# Altium schematic sheet DP_PS.schdoc: TEBF0808 - DisplayPort
size A4; DocumentNumber: TEBF0808; Revision: 04; SheetNumber: 10; SheetTotal: 36; Date: 2016-09-29; CompanyName: Trenz Electronic GmbH; Organization: Trenz Electronic GmbH
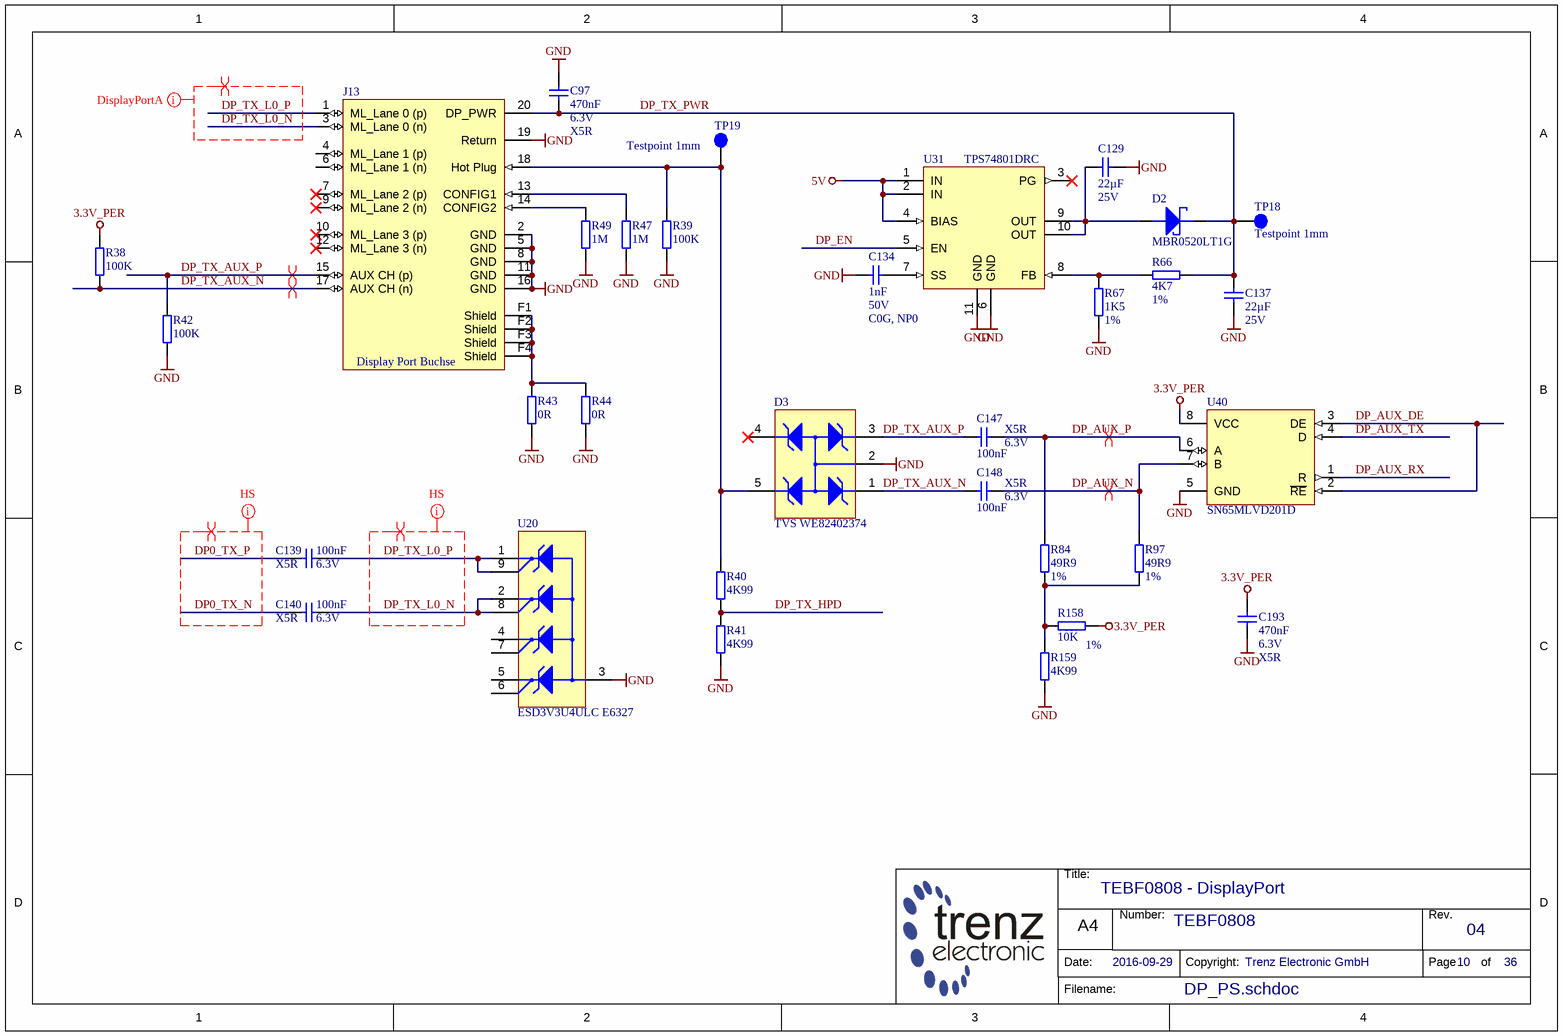
[diagram p0: DP_PS.schdoc]

## Parts
C97  470nF  Voltage: 6.3V  Technology: X5R  [CAPC1005X55N]
C129  22µF  Voltage: 25V  [CAPC3216X180N]
C134  1nF  Voltage: 50V  Technology: C0G, NP0  [CAPC1005X55N]
C137  22µF  Voltage: 25V  [CAPC3216X180N]
C139  100nF  Voltage: 6.3V  Technology: X5R  [CAPC0603X33N]
C140  100nF  Voltage: 6.3V  Technology: X5R  [CAPC0603X33N]
C147  100nF  Voltage: 6.3V  Technology: X5R  [CAPC0603X33N]
C148  100nF  Voltage: 6.3V  Technology: X5R  [CAPC0603X33N]
C193  470nF  Voltage: 6.3V  Technology: X5R  [CAPC1005X55N]
D2  MBR0520LT1G  [SOD3816X120N]
D3  TVS WE82402374  [SOT65P210X110-5N]
J13  Display Port Buchse  [8470-2-2-X]
R38  100K  [RESC1005X40N]
R39  100K  [RESC1005X40N]
R40  4K99  [RESC1005X40N]
R41  4K99  [RESC1005X40N]
R42  100K  [RESC1005X40N]
R43  0R  [RESC1005X40N]
R44  0R  [RESC1005X40N]
R47  1M  [RESC1005X40N]
R49  1M  [RESC1005X40N]
R66  4K7  Tolerance: 1%  [RESC1005X40N]
R67  1K5  Tolerance: 1%  [RESC1005X40N]
R84  49R9  Tolerance: 1%  [RESC1005X40N]
R97  49R9  Tolerance: 1%  [RESC1005X40N]
R158  10K  Tolerance: 1%  [RESC1005X40N]
R159  4K99  [RESC1005X40N]
TP18  Testpoint 1mm  [TP_1mm]
TP19  Testpoint 1mm  [TP_1mm]
U20  ESD3V3U4ULC E6327  [TSLP-9-1]
U31  TPS74801DRC  [SON50P300X300X100-11N-TI]
U40  SN65MLVD201D  [SOIC127P600X175-8N]

## Nets
3.3V_PER: C193.1 R38.1 R158.1 U40.8(VCC)
5V: U31.1(IN) U31.2(IN) U31.4(BIAS)
GND: C97.2 C129.2 C134.1 C137.1 C193.2 D3.2 J13.2(GND) J13.5(GND) J13.8(GND) J13.11(GND) J13.16(GND) J13.19(Return) R39.2 R41.1 R42.2 R43.1 R44.1 R47.1 R49.2 R67.2 R159.1 U20.3 U31.6(GND) U31.11(GND) U40.5(GND)
DP0_TX_N: C140.1
DP0_TX_P: C139.1
DP_AUX_DE: U40.2(~{RE}) U40.3(DE)
DP_AUX_N: C148.2 R97.1 U40.7(B)
DP_AUX_P: C147.2 R84.1 U40.6(A)
DP_AUX_RX: U40.1(R)
DP_AUX_TX: U40.4(D)
DP_EN: U31.5(EN)
DP_TX_AUX_N: C148.1 D3.1 J13.17(AUX CH (n)) R38.2
DP_TX_AUX_P: C147.1 D3.3 J13.15(AUX CH (p)) R42.1
DP_TX_HPD: R40.1 R41.2
DP_TX_L0_N: C140.2 J13.3(ML_Lane 0 (n)) U20.2 U20.8
DP_TX_L0_P: C139.2 J13.1(ML_Lane 0 (p)) U20.1 U20.9
DP_TX_PWR: C97.1 C137.2 D2.1(KATHODE) J13.20(DP_PWR) R66.2 TP18.1
NetC129_1: C129.1 D2.2(ANODE) U31.9(OUT) U31.10(OUT)
NetC134_2: C134.2 U31.7(SS)
NetD3_5: D3.5 J13.18(Hot Plug) R39.1 R40.2 TP19.1
NetJ13_13: J13.13(CONFIG1) R47.2
NetJ13_14: J13.14(CONFIG2) R49.1
NetJ13_F1: J13.F1(Shield) J13.F2(Shield) J13.F3(Shield) J13.F4(Shield) R43.2 R44.2
NetR66_1: R66.1 R67.1 U31.8(FB)
NetR84_2: R84.2 R97.2 R158.2 R159.2

Not connected (* = marked no-connect by the designer): D3 4*; J13 4(ML_Lane 1 (p)) 6(ML_Lane 1 (n)) 7(ML_Lane 2 (p))* 9(ML_Lane 2 (n))* 10(ML_Lane 3 (p))* 12(ML_Lane 3 (n))*; U20 4 5 6 7; U31 3(PG)*

## Layout directives
differential pair: DP0_TX_N, DP0_TX_P, DP_AUX_N, DP_AUX_P, DP_TX_AUX_N, DP_TX_AUX_P, DP_TX_L0_N, DP_TX_L0_P
net class DisplayPortA: DP_TX_L0_N, DP_TX_L0_P
net class HS: DP0_TX_N, DP0_TX_P, DP_TX_L0_N, DP_TX_L0_P

## Notes on the sheet
- Title:
- Number:
- Rev.
- Date:
- A4
- Copyright:
- Page
- of
- Filename:

## Library data of the parts
C97 C193 = 23659: KON 470nF 6,3V X5R SMD; AN: 23659; Value: 470n; Mixed: SMT; Preferred: Yes; Case: 1005 (0402)
C129 C137 = 24886: KON 22µF X5R 25V SMD 10%; AN: 24886; Value: 22u; Mixed: SMT; Preferred: Yes; Case: 3216 (1206); Tolerance: 10%
C134 = 23752: KON 1nF NP0 SMD 5%; AN: 23752; Mixed: SMT; Value: 1n; Case: 1005 (0402); Tolerance: 5%
C139 C140 C147 C148 = 24915: KON 100nF 6.3V X5R SMD 10%; AN: 24915; Mixed: SMT; Value: 100n; Preferred: Yes; Case: 0603 (0201); Tolerance: 10%
D2 = 26768: AN: 26768; Voltage: 0.5A; Mixed: SMT; Value: 20V; Case: SOD123-FC; HelpURL: B:\AD\adlib\datasheet\MBR0520; H-ART: MBR0520LT1G
D3 = 25362: WE-TVS Array 82402374; AN: 25362; Mixed: SMT; Case: SC70-5; HelpURL: B:\AD\adlib\datasheet\82402374; H-ART: 82402374
J13 = 23865: DisplayPort Verbinder, Buchse liegend; AN: 23865; Mixed: SMT; Trenz-Stock: Yes; H-ART: 0472720001; HelpURL: B:\AD\adlib\datasheet\DisplayPort
R38 R39 R42 = 22558: WID SMD 100K 1% 0,063W; AN: 22558; Mixed: SMT; Preferred: Yes; Tolerance: 1%; Case: 1005 (0402); Technology: TK100; Value: 100K
R40 R41 R159 = 22754: WID SMD 4K99 1% 0,063W; AN: 22754; Mixed: SMT; Value: 4.99K; Preferred: Yes; Case: 1005 (0402); Tolerance: 1%; Technology: TK100
R43 R44 = 22738: WID SMD 0R; AN: 22738; Tolerance: 1%; Mixed: SMT; Value: 0; Preferred: Yes; Case: 1005 (0402); Technology: TK100
R47 R49 = 22599: WID SMD 1M 1% 0,063W; AN: 22599; Mixed: SMT; Tolerance: 1%; Case: 1005 (0402); Technology: TK100; Value: 1M
R66 = 22585: WID SMD 4K7 1% 0,063W; AN: 22585; Mixed: SMT; Value: 4.7K; Preferred: Yes; Case: 1005 (0402); Technology: TK100
R67 = 22602: WID SMD 1K5 1% 0,063W; AN: 22602; Mixed: SMT; Value: 1.5K; Preferred: Yes; Case: 1005 (0402); Technology: TK100
R84 R97 = 23135: WID SMD 49R9 1% 0,063W; AN: 23135; Mixed: SMT; Value: 49.9; Preferred: Yes; Case: 1005 (0402); Technology: TK100
R158 = 22750: WID SMD 10K 1% 0,063W; AN: 22750; Mixed: SMT; Preferred: Yes; Case: 1005 (0402); Technology: TK100; Value: 10K
TP18 TP19 = 25063: AN: 25063; Mixed: SMT
U20 = 25369: TVS UL Cap. 4xIOs ESD 3.3V; AN: 25369; Mixed: SMT; Case: TSLP-9-1; HelpURL: B:\AD\adlib\datasheet\ESD3V3U4ULC; H-ART: ESD3V3U4ULC E6327
U31 = 25235: AN: 25235; Mixed: SMT; Trenz-Stock: Yes; Case: DRC (S-PVSON-N10); HelpURL: B:\AD\adlib\datasheet\TPS74801; H-ART: TPS74801DRC
U40 = 26577: AN: 26577; Mixed: SMT; Trenz-Stock: Yes; Case: SO8; HelpURL: B:\ad\adlib\datasheet\SN65MLVD201D; H-ART: SN65MLVD201D